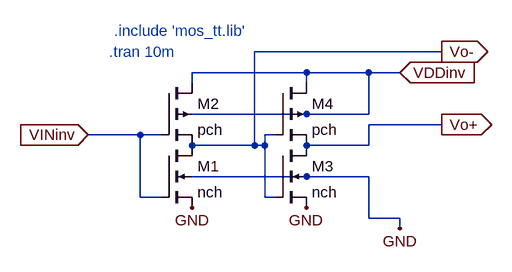
[diagram p0: schematic INVSW.asc]
INVSW.asc, the LTspice schematic file:
Version 4
SHEET 1 880 680
WIRE 544 32 256 32
WIRE 336 64 160 64
WIRE 432 64 336 64
WIRE 480 64 432 64
WIRE 160 80 160 64
WIRE 336 80 336 64
WIRE 336 128 160 128
WIRE 432 128 432 64
WIRE 432 128 336 128
WIRE 544 144 432 144
WIRE 80 160 0 160
WIRE 112 160 80 160
WIRE 288 160 272 160
WIRE 256 176 256 32
WIRE 256 176 160 176
WIRE 272 176 272 160
WIRE 272 176 256 176
WIRE 432 176 432 144
WIRE 432 176 336 176
WIRE 336 224 160 224
WIRE 432 224 336 224
WIRE 80 256 80 160
WIRE 112 256 80 256
WIRE 272 256 272 176
WIRE 288 256 272 256
WIRE 432 288 432 224
WIRE 480 288 432 288
WIRE 480 304 480 288
FLAG 480 304 GND
FLAG 160 272 GND
FLAG 336 272 GND
FLAG 544 144 Vo+
IOPIN 544 144 Out
FLAG 544 32 Vo-
IOPIN 544 32 Out
FLAG 480 64 VDDinv
IOPIN 480 64 In
FLAG 0 160 VINinv
IOPIN 0 160 In
SYMBOL nmos4 112 176 R0
SYMATTR InstName M1
SYMATTR Value nch
SYMATTR Value2 l=2u w=6u ad=4.2e-11 as=4.2e-11 pd=20e-6 ps=20e-6
SYMBOL pmos4 112 80 R0
SYMATTR InstName M2
SYMATTR Value pch
SYMATTR Value2 l=2u w=10u ad=7e-11 as=7e-11 pd=24e-6 ps=24e-6
SYMBOL nmos4 288 176 R0
SYMATTR InstName M3
SYMATTR Value nch
SYMATTR Value2 l=2u w=12u ad=8.4e-11 as=8.4e-11 pd=26e-6 ps=26e-6
SYMBOL pmos4 288 80 R0
SYMATTR InstName M4
SYMATTR Value pch
SYMATTR Value2 l=2u w=20u ad=1.4e-10 as=1.4e-10 pd=34e-6 ps=34e-6
TEXT 32 32 Left 2 ;.tran 10m
TEXT 40 0 Left 2 ;.include 'mos_tt.lib'

The netlist it stands for:
* INVSW.asc
M1 Vo- VINinv GND GND nch l=2u w=6u ad=4.2e-11 as=4.2e-11 pd=20e-6 ps=20e-6
M2 VDDinv VINinv Vo- VDDinv pch l=2u w=10u ad=7e-11 as=7e-11 pd=24e-6 ps=24e-6
M3 Vo+ Vo- GND GND nch l=2u w=12u ad=8.4e-11 as=8.4e-11 pd=26e-6 ps=26e-6
M4 VDDinv Vo- Vo+ VDDinv pch l=2u w=20u ad=1.4e-10 as=1.4e-10 pd=34e-6 ps=34e-6
.model NMOS NMOS
.model PMOS PMOS
.lib standard.mos
* .tran 10m
* .include 'mos_tt.lib'
.backanno
.end